# Altium schematic sheet РЕУН.468332.001_Inputs.SchDoc: =Name-1str
size 594 x 420 mm; SheetNumber: 5; Вид изделия: Документация; Раздел: Документация; Код документа: Э3; Вид документа: Схема электрическая принципиальная; Класс документа: Конструкторский документ; Создавать изделие в PLM: Yes; DocumentCode: РЕУН.468332.001 Э3 2D; DocumentView: Схема электрическая принципиальная; DocumentClass: Конструкторский документ; ProductView: Документация; Format: A2
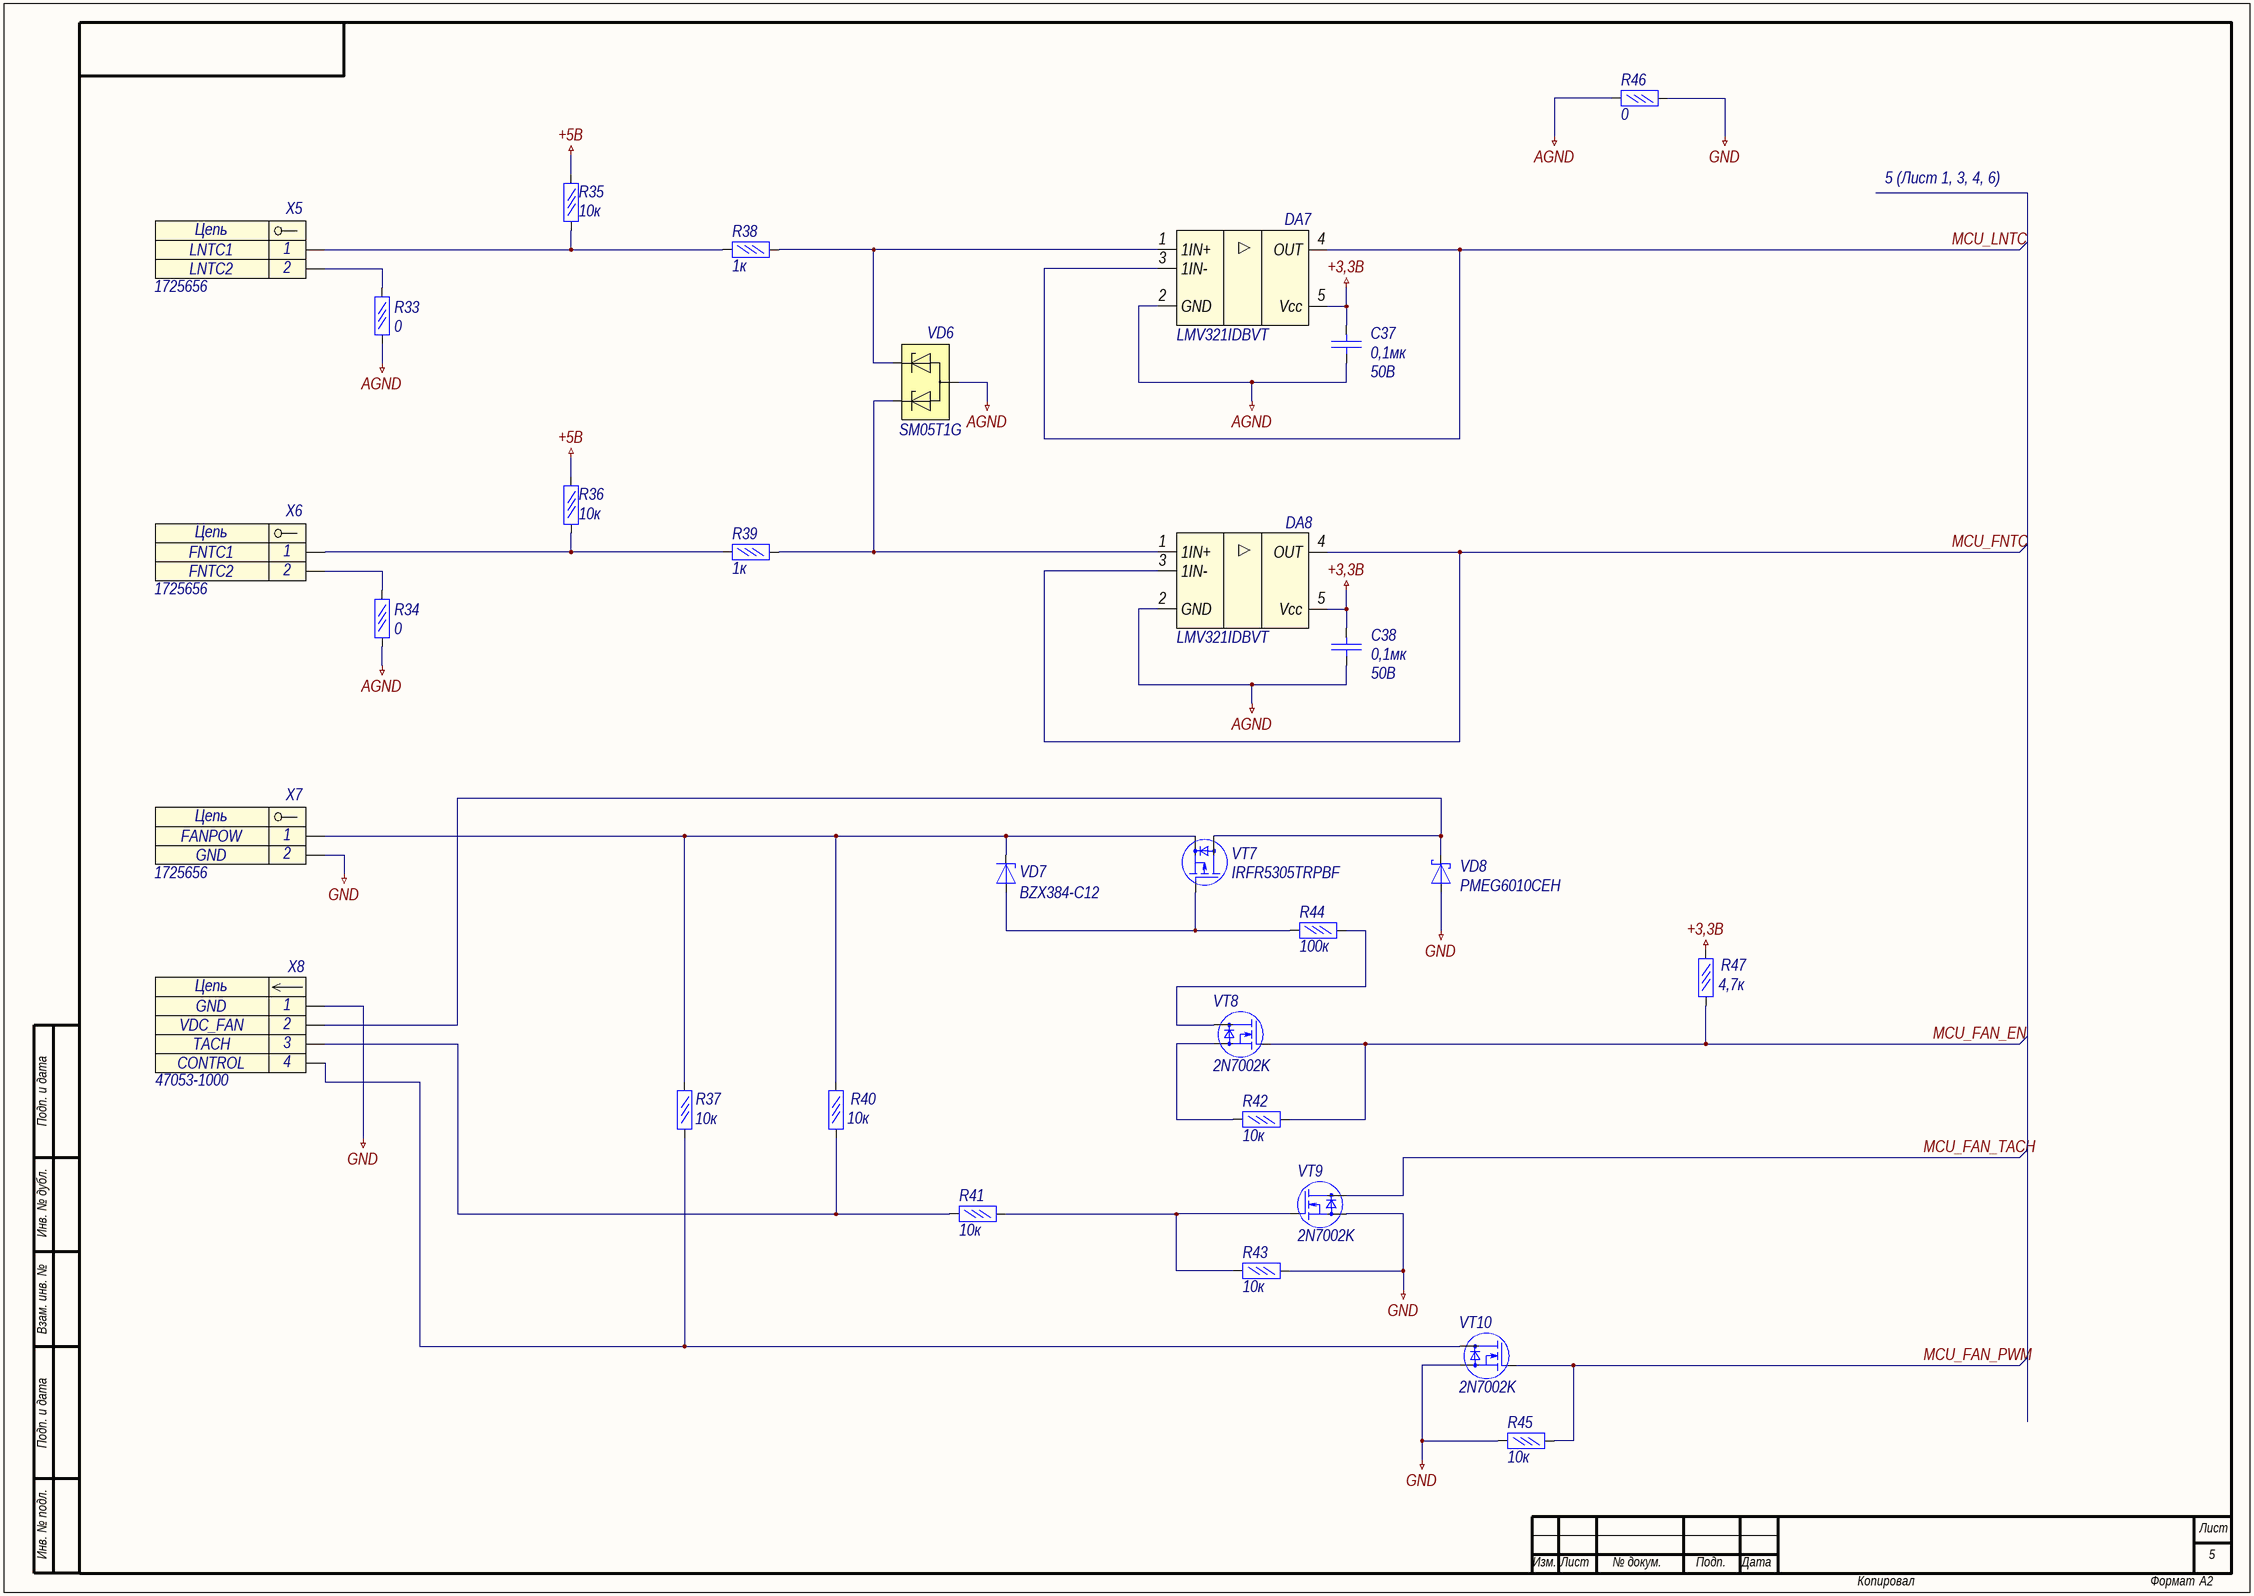
[diagram p0: РЕУН.468332.001_Inputs.SchDoc]

## Parts
C37  Voltage: 50В  [C0805_AA]  (hidden comment: 0,1мк)
C38  Voltage: 50В  [C0805_AA]  (hidden comment: 0,1мк)
DA7  LMV321IDBVT
DA8  LMV321IDBVT
R33  0  [R1206]
R34  0  [R1206]
R35  10к  [R1206]
R36  10к  [R1206]
R37  10к  [R1206]
R38  1к  [R1206]
R39  1к  [R1206]
R40  10к  [R1206]
R41  10к  [R1206]
R42  10к  [R1206]
R43  10к  [R1206]
R44  100к  [R1206]
R45  10к  [R1206]
R46  0  [R1206]
R47  4,7к  [R1206]
VD6  SM05T1G
VD7  BZX384-C12  [SOT23-2_A]
VD8  PMEG6010CEH  [SOD123_A]
VT7  IRFR5305TRPBF
VT8  2N7002K  [SOT23-3]
VT9  2N7002K  [SOT23-3]
VT10  2N7002K  [SOT23-3]
X5  1725656
X6  1725656
X7  1725656
X8  47053-1000

## Nets
+3,3В: C37.2 C38.2 DA7.5(Vcc) DA8.5(Vcc) R47.2
+5В: R35.2 R36.2
AGND: C37.1 C38.1 DA7.2(GND) DA8.2(GND) R33.1 R34.1 R46.2 VD6.3
GND: R43.1 R45.2 R46.1 VD8.2(A) VT9.2(S) VT10.2(S) X7.2 X8.1
MCU_FAN_EN: R42.1 R47.1 VT8.1(G)
MCU_FAN_PWM: R45.1 VT10.1(G)
MCU_FAN_TACH: VT9.3(D)
MCU_FNTC: DA8.3(1IN-) DA8.4(OUT)
MCU_LNTC: DA7.3(1IN-) DA7.4(OUT)
NetDA7_1: DA7.1(1IN+) R38.2 VD6.2
NetDA8_1: DA8.1(1IN+) R39.2 VD6.1
NetR33_2: R33.2 X5.2
NetR34_2: R34.2 X6.2
NetR35_1: R35.1 R38.1 X5.1
NetR36_1: R36.1 R39.1 X6.1
NetR37_1: R37.1 VT10.3(D) X8.4
NetR37_2: R37.2 R40.2 VD7.1(K) VT7.2(S) X7.1
NetR40_1: R40.1 R41.1 X8.3
NetR41_2: R41.2 R43.2 VT9.1(G)
NetR42_2: R42.2 VT8.2(S)
NetR44_1: R44.1 VD7.2(A) VT7.1(G)
NetR44_2: R44.2 VT8.3(D)
NetVD8_1: VD8.1(K) VT7.3(D) X8.2

## Notes on the sheet
- 5 (Лист 1, 3, 4, 6)
- Подп. и дата
- Инв. № дубл.
- Взам. инв. №
- Инв. № подл.
- Лист
- Изм.
- № докум.
- Подп.
- Дата
- Копировал
- Формат
- (in symbol x1-k_1) Цепь
- (in symbol x10-m_1) Цепь

## Library data of the parts
C37 C38 = Конденсатор кер.: Value: 0,1мк
DA7 DA8 = LMV321: Операционный усилитель Rail-to-rail
R33 R34 = Резистор  0,05Вт: Резистор 0,05Вт; Name: RC0603FR-070RL; Power rating: 0,05Вт; Value: 0
R35-R37 R40-R43 R45 R46 = Резистор  0,05Вт: Резистор 0,05Вт; Name: RC0603FR-0710KL; Power rating: 0,05Вт
  R35-R37 R40-R43 R45: Value: 10к
  R46: Value: 0
R38 R39 = Резистор  0,05Вт: Резистор 0,05Вт; Name: RC0603FR-071KL; Power rating: 0,05Вт; Value: 1к
R44 = Резистор  0,05Вт: Резистор 0,05Вт; Name: RC0603FR-07100KL; Power rating: 0,05Вт; Value: 100к
R47 = Резистор  0,05Вт: Резистор 0,05Вт; Name: RC0603FR-074K7L; Power rating: 0,05Вт; Value: 4,7к
VD6 = ZenerArray2: Сборка TVS-диодов
VD7 = DiodeZener: Стабилитрон; Name: BZX384-C12
VD8 = DiodeSchottky: Диод Шоттки; Name: PMEG6010CEH
VT7 = mosfet-p-1-3-2: Полевой P-канальный транзистор; Name: IRFR5305TRPBF
VT8-VT10 = mosfet-n: Name: 2N7002K
X5 = x1-k_1: Разъем - 1 конт. клемма; Contact_1: LNTC1; Contact_2: LNTC2; Name: 1725656
X6 = x1-k_1: Разъем - 1 конт. клемма; Contact_1: FNTC1; Contact_2: FNTC2; Name: 1725656
X7 = x1-k_1: Разъем - 1 конт. клемма; Contact_1: FANPOW; Contact_2: GND; Name: 1725656
X8 = x10-m_1: Разъем - 10 конт. вилка; Contact_1: GND; Contact_2: VDC_FAN; Contact_3: TACH; Contact_4: CONTROL; Contact_5: Contact_5; Contact_6: Contact_6; Contact_7: Contact_7; Contact_8: Contact_8; Name: 47053-1000